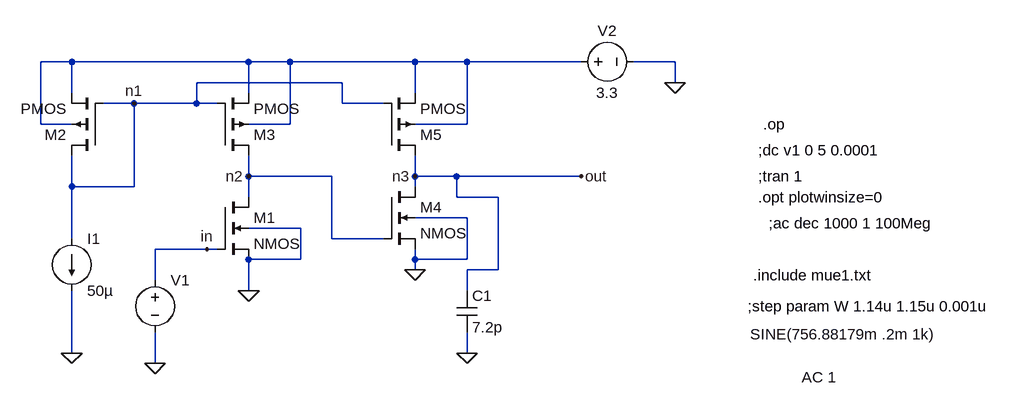
[diagram p0: schematic final_1 - Copy.asc]
final_1 - Copy.asc, the LTspice schematic file:
Version 4
SHEET 1 4072 680
WIRE 80 -16 32 -16
WIRE 352 -16 80 -16
WIRE 416 -16 352 -16
WIRE 608 -16 416 -16
WIRE 688 -16 608 -16
WIRE 864 -16 688 -16
WIRE 1008 -16 944 -16
WIRE 496 16 272 16
WIRE 1008 16 1008 -16
WIRE 80 32 80 -16
WIRE 352 32 352 -16
WIRE 608 32 608 -16
WIRE 176 48 128 48
WIRE 272 48 272 16
WIRE 272 48 176 48
WIRE 304 48 272 48
WIRE 496 48 496 16
WIRE 560 48 496 48
WIRE 32 80 32 -16
WIRE 80 80 32 80
WIRE 416 80 416 -16
WIRE 416 80 352 80
WIRE 688 80 688 -16
WIRE 688 80 608 80
WIRE 352 160 352 128
WIRE 480 160 352 160
WIRE 608 160 608 128
WIRE 672 160 608 160
WIRE 864 160 672 160
WIRE 80 176 80 128
WIRE 176 176 176 48
WIRE 176 176 80 176
WIRE 608 176 608 160
WIRE 352 192 352 160
WIRE 672 192 672 160
WIRE 736 192 672 192
WIRE 688 224 608 224
WIRE 432 240 352 240
WIRE 80 256 80 176
WIRE 480 256 480 160
WIRE 560 256 480 256
WIRE 288 272 208 272
WIRE 304 272 288 272
WIRE 432 288 432 240
WIRE 432 288 352 288
WIRE 608 288 608 272
WIRE 688 288 688 224
WIRE 688 288 608 288
WIRE 608 304 608 288
WIRE 736 304 736 192
WIRE 736 304 688 304
WIRE 208 320 208 272
WIRE 352 336 352 288
WIRE 688 336 688 304
WIRE 80 432 80 336
WIRE 688 432 688 400
WIRE 208 448 208 400
FLAG 352 336 0
FLAG 208 448 0
FLAG 80 432 0
FLAG 1008 16 0
FLAG 288 272 in
FLAG 608 304 0
FLAG 864 160 out
FLAG 176 48 n1
FLAG 352 160 n2
FLAG 608 160 n3
FLAG 688 432 0
DATAFLAG 736 -16 ""
SYMBOL nmos4 304 192 R0
SYMATTR InstName M1
SYMATTR Value2 l=1.2u w=20u
SYMBOL voltage 208 304 R0
WINDOW 123 995 165 Left 2
WINDOW 39 0 0 Left 0
WINDOW 3 916 99 Left 2
SYMATTR Value2 AC 1
SYMATTR Value SINE(756.88179m .2m 1k)
SYMATTR InstName V1
SYMBOL current 80 256 R0
WINDOW 123 0 0 Left 0
WINDOW 39 0 0 Left 0
SYMATTR InstName I1
SYMATTR Value 50µ
SYMBOL pmos4 128 128 R180
SYMATTR InstName M2
SYMATTR Value2 l=1.2u w=50u
SYMBOL pmos4 304 128 M180
SYMATTR InstName M3
SYMATTR Value2 l=1.2u w=4u
SYMBOL voltage 848 -16 R270
WINDOW 0 32 56 VTop 2
WINDOW 3 -32 56 VBottom 2
WINDOW 123 0 0 Left 0
WINDOW 39 0 0 Left 0
SYMATTR InstName V2
SYMATTR Value 3.3
SYMBOL nmos4 560 176 R0
SYMATTR InstName M4
SYMATTR Value2 l=1.2u w=1.145u
SYMBOL pmos4 560 128 M180
SYMATTR InstName M5
SYMATTR Value2 l=1.2u w=14.571u
SYMBOL cap 672 336 R0
SYMATTR InstName C1
SYMATTR Value 7.2p
TEXT 1144 80 Left 2 !.op
TEXT 1136 120 Left 2 !;dc v1 0 5 0.0001
TEXT 1136 160 Left 2 !;tran 1
TEXT 1136 192 Left 2 !.opt plotwinsize=0
TEXT 1128 312 Left 2 !.include mue1.txt
TEXT 1120 360 Left 2 !;step param W 1.14u 1.15u 0.001u
TEXT 1152 232 Left 2 !;ac dec 1000 1 100Meg

The netlist it stands for:
* final_1 - Copy.asc
M1 n2 in 0 0 NMOS l=1.2u w=20u
V1 in 0 SINE(756.88179m .2m 1k) AC 1
I1 n1 0 50µ
M2 n1 n1 N001 N001 PMOS l=1.2u w=50u
M3 n2 n1 N001 N001 PMOS l=1.2u w=4u
V2 N001 0 3.3
M4 n3 n2 0 0 NMOS l=1.2u w=1.145u
M5 n3 n1 N001 N001 PMOS l=1.2u w=14.571u
C1 n3 0 7.2p
.model NMOS NMOS
.model PMOS PMOS
.lib standard.mos
.op
;dc v1 0 5 0.0001
;tran 1
.opt plotwinsize=0
.include mue1.txt
;step param W 1.14u 1.15u 0.001u
;ac dec 1000 1 100Meg
.backanno
.end